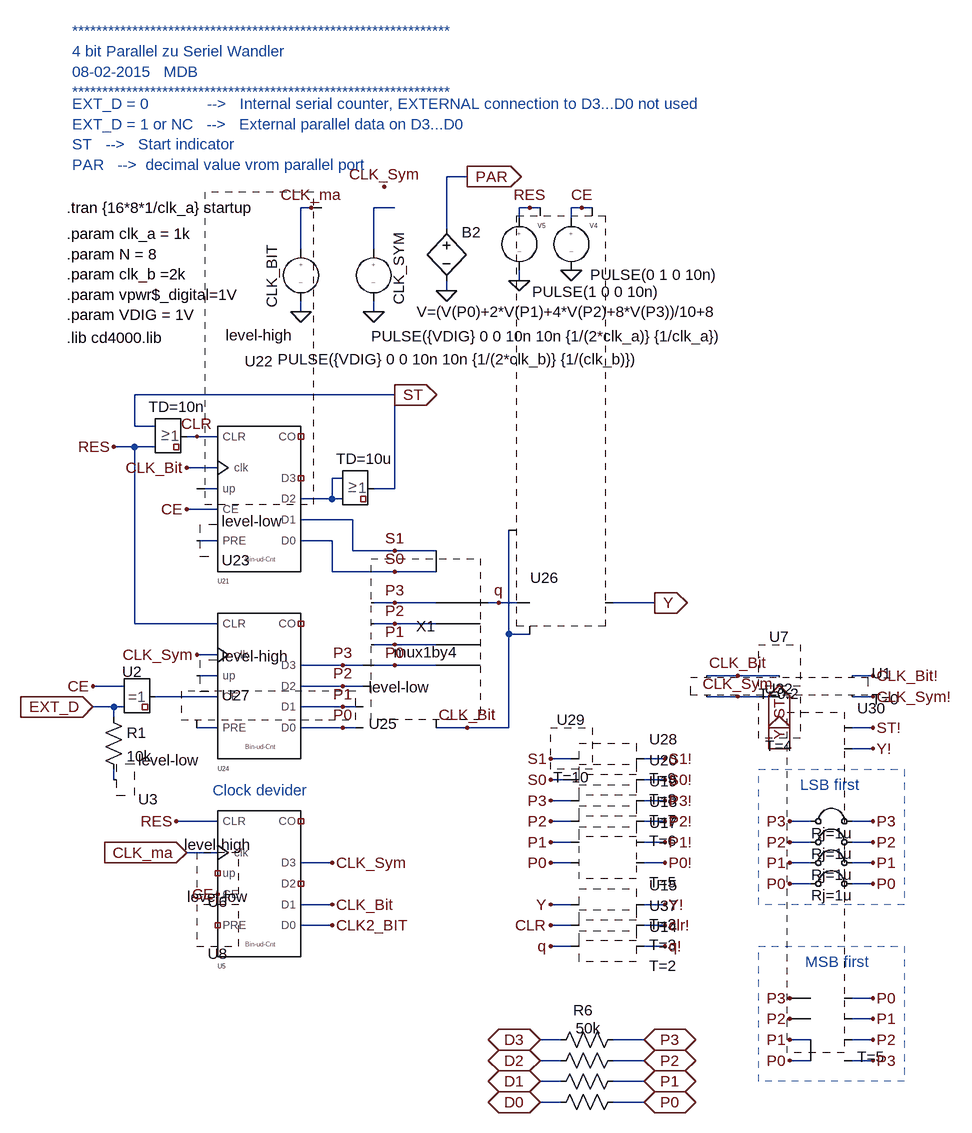
[diagram p0: schematic par4_to_serial_LOGIC_ANALYZER.asc]
par4_to_serial_LOGIC_ANALYZER.asc, the LTspice schematic file:
Version 4
SHEET 1 1748 680
WIRE 368 -992 336 -992
WIRE 128 -944 112 -944
WIRE 144 -944 128 -944
WIRE 256 -944 224 -944
WIRE 464 -944 448 -944
WIRE 480 -944 464 -944
WIRE 544 -944 528 -944
WIRE 560 -944 544 -944
WIRE 448 -928 448 -944
WIRE 528 -928 528 -944
WIRE 336 -912 336 -992
WIRE 112 -880 112 -944
WIRE 224 -880 224 -944
WIRE 448 -832 448 -848
WIRE 336 -816 336 -832
WIRE 112 -784 112 -800
WIRE 224 -784 224 -800
WIRE 256 -656 -144 -656
WIRE -144 -608 -144 -656
WIRE -112 -608 -144 -608
WIRE -48 -592 -64 -592
WIRE -16 -592 -48 -592
WIRE -144 -576 -176 -576
WIRE -112 -576 -144 -576
WIRE -16 -544 -64 -544
WIRE 176 -528 160 -528
WIRE -16 -512 -48 -512
WIRE 256 -512 256 -656
WIRE 256 -512 224 -512
WIRE 160 -496 160 -528
WIRE 160 -496 112 -496
WIRE 176 -496 160 -496
WIRE -16 -480 -64 -480
WIRE 192 -464 112 -464
WIRE -16 -432 -48 -432
WIRE 160 -432 112 -432
WIRE 192 -416 192 -464
WIRE 256 -416 192 -416
WIRE 320 -416 256 -416
WIRE 160 -384 160 -432
WIRE 256 -384 160 -384
WIRE 320 -384 256 -384
WIRE 256 -336 224 -336
WIRE 320 -336 256 -336
WIRE 416 -336 400 -336
WIRE 464 -336 416 -336
WIRE 656 -336 592 -336
WIRE -144 -304 -144 -576
WIRE -16 -304 -144 -304
WIRE 256 -304 224 -304
WIRE 320 -304 256 -304
WIRE 432 -288 432 -448
WIRE 464 -288 432 -288
WIRE 256 -272 224 -272
WIRE 320 -272 256 -272
WIRE -16 -256 -48 -256
WIRE 176 -240 112 -240
WIRE 208 -240 176 -240
WIRE 256 -240 224 -240
WIRE 320 -240 256 -240
WIRE -16 -224 -48 -224
WIRE 784 -224 736 -224
WIRE 848 -224 784 -224
WIRE 992 -224 960 -224
WIRE -160 -208 -208 -208
WIRE 176 -208 112 -208
WIRE 208 -208 176 -208
WIRE -16 -192 -112 -192
WIRE 784 -192 736 -192
WIRE 848 -192 784 -192
WIRE 992 -192 960 -192
WIRE -176 -176 -208 -176
WIRE -160 -176 -176 -176
WIRE 176 -176 112 -176
WIRE 208 -176 176 -176
WIRE -176 -160 -176 -176
WIRE -16 -144 -48 -144
WIRE 176 -144 112 -144
WIRE 208 -144 176 -144
WIRE 368 -144 320 -144
WIRE 432 -144 432 -288
WIRE 432 -144 368 -144
WIRE 992 -144 960 -144
WIRE 992 -112 960 -112
WIRE 528 -96 496 -96
WIRE 672 -96 640 -96
WIRE -176 -64 -176 -80
WIRE 528 -64 496 -64
WIRE 672 -64 640 -64
WIRE 528 -32 496 -32
WIRE 672 -32 640 -32
WIRE -16 0 -80 0
WIRE 528 0 496 0
WIRE 672 0 640 0
WIRE 896 0 864 0
WIRE 992 0 960 0
WIRE 528 32 496 32
WIRE 672 32 640 32
WIRE 896 32 864 32
WIRE 992 32 960 32
WIRE -16 48 -64 48
WIRE 160 64 112 64
WIRE 528 64 496 64
WIRE 672 64 640 64
WIRE 896 64 864 64
WIRE 992 64 960 64
WIRE 896 96 864 96
WIRE 992 96 960 96
WIRE 160 128 112 128
WIRE 528 128 496 128
WIRE 672 128 640 128
WIRE 160 160 112 160
WIRE 528 160 496 160
WIRE 672 160 640 160
WIRE 528 192 496 192
WIRE 672 192 640 192
WIRE 896 272 864 272
WIRE 992 272 960 272
WIRE 896 304 864 304
WIRE 992 304 960 304
WIRE 512 336 480 336
WIRE 640 336 592 336
WIRE 896 336 864 336
WIRE 992 336 960 336
WIRE 512 368 480 368
WIRE 640 368 592 368
WIRE 896 368 864 368
WIRE 992 368 960 368
WIRE 512 400 480 400
WIRE 640 400 592 400
WIRE 512 432 480 432
WIRE 640 432 592 432
FLAG 224 -784 0
FLAG 112 -784 0
FLAG 256 -416 S1
FLAG 256 -384 S0
FLAG 672 128 Y!
FLAG 672 64 P0!
FLAG 672 32 P1!
FLAG 672 0 P2!
FLAG 672 -32 P3!
FLAG 496 64 P0
FLAG 496 32 P1
FLAG 496 0 P2
FLAG 496 -32 P3
FLAG 544 -944 CE
FLAG 528 -848 0
FLAG -64 -480 CE
FLAG -208 -208 CE
FLAG 672 -64 S0!
FLAG 672 -96 S1!
FLAG 496 -64 S0
FLAG 496 -96 S1
FLAG 464 -944 RES
FLAG 448 -832 0
FLAG -176 -576 RES
FLAG 336 -816 0
FLAG 368 -992 PAR
IOPIN 368 -992 Out
FLAG 496 128 Y
FLAG 672 160 clr!
FLAG -48 -592 CLR
FLAG 496 160 CLR
FLAG 480 336 D3
IOPIN 480 336 BiDir
FLAG 480 368 D2
IOPIN 480 368 BiDir
FLAG 480 400 D1
IOPIN 480 400 BiDir
FLAG 480 432 D0
IOPIN 480 432 BiDir
FLAG -208 -176 EXT_D
IOPIN -208 -176 In
FLAG 992 -192 CLK_Sym!
FLAG 992 -224 CLK_Bit!
FLAG 256 -656 ST
IOPIN 256 -656 Out
FLAG -64 -544 CLK_Bit
FLAG -48 -256 CLK_Sym
FLAG -80 0 RES
FLAG -64 48 CLK_ma
IOPIN -64 48 In
FLAG -16 112 CE
FLAG 160 64 CLK_Sym
FLAG 128 -944 CLK_ma
FLAG 240 -976 CLK_Sym
FLAG 640 336 P3
IOPIN 640 336 BiDir
FLAG 640 368 P2
IOPIN 640 368 BiDir
FLAG 640 400 P1
IOPIN 640 400 BiDir
FLAG 640 432 P0
IOPIN 640 432 BiDir
FLAG 784 -224 CLK_Bit
FLAG 784 -192 CLK_Sym
FLAG 176 -240 P3
FLAG 176 -208 P2
FLAG 176 -176 P1
FLAG 176 -144 P0
FLAG 864 0 P3
FLAG 864 32 P2
FLAG 864 64 P1
FLAG 864 96 P0
FLAG 992 0 P3
FLAG 992 32 P2
FLAG 992 64 P1
FLAG 992 96 P0
FLAG 864 272 P3
FLAG 864 304 P2
FLAG 864 336 P1
FLAG 864 368 P0
FLAG 992 368 P3
FLAG 992 336 P2
FLAG 992 304 P1
FLAG 992 272 P0
FLAG 416 -336 q
FLAG 256 -336 P3
FLAG 256 -304 P2
FLAG 256 -272 P1
FLAG 256 -240 P0
FLAG 672 192 q!
FLAG 496 192 q
FLAG 992 -112 Y!
FLAG 160 128 CLK_Bit
FLAG 160 160 CLK2_BIT
FLAG 656 -336 Y
IOPIN 656 -336 Out
FLAG 992 -144 ST!
FLAG 848 -112 Y
IOPIN 848 -112 Out
FLAG 848 -144 ST
IOPIN 848 -144 Out
FLAG 368 -144 CLK_Bit
SYMBOL EIT_Digital\\probe_dig 848 -208 R0
SYMATTR Value T=0
SYMATTR InstName U1
SYMBOL source-V 224 -896 R0
WINDOW 3 -4 150 Left 2
WINDOW 123 0 0 Left 2
WINDOW 39 0 0 Left 2
WINDOW 0 39 -10 VRight 2
SYMATTR Value PULSE({VDIG} 0 0 10n 10n {1/(2*clk_a)} {1/clk_a})
SYMATTR InstName CLK_SYM
SYMBOL source-V 112 -896 R0
WINDOW 3 -36 185 Left 2
WINDOW 0 -45 9 VRight 2
WINDOW 123 0 0 Left 2
WINDOW 39 0 0 Left 2
SYMATTR Value PULSE({VDIG} 0 0 10n 10n {1/(2*clk_b)} {1/(clk_b)})
SYMATTR InstName CLK_BIT
SYMBOL EIT_Digital\\probe_dig 848 -240 R0
SYMATTR Value T=0.2
SYMATTR InstName U7
SYMBOL EIT_Digital\\probe_dig 528 112 R0
SYMATTR Value T=3
SYMATTR InstName U15
SYMBOL EIT_Digital\\probe_dig 528 48 R0
SYMATTR Value T=5
SYMATTR InstName U17
SYMBOL EIT_Digital\\probe_dig 528 16 R0
SYMATTR Value T=6
SYMATTR InstName U18
SYMBOL EIT_Digital\\probe_dig 528 -16 R0
SYMATTR Value T=7
SYMATTR InstName U19
SYMBOL EIT_Digital\\probe_dig 528 -48 R0
SYMATTR Value T=8
SYMATTR InstName U20
SYMBOL EIT_Digital\\Bin_up_down_counter -16 -432 M180
WINDOW 3 1 191 Invisible 2
SYMATTR InstName U21
SYMBOL EIT_Digital\\level-high -48 -512 M180
SYMATTR InstName U22
SYMBOL EIT_Digital\\level-low -48 -432 M180
SYMATTR InstName U23
SYMBOL EIT_Digital\\Bin_up_down_counter -16 -144 M180
WINDOW 3 1 191 Invisible 2
SYMATTR InstName U24
SYMBOL EIT_Digital\\level-low -48 -144 M180
SYMATTR InstName U25
SYMBOL source-V 528 -944 R0
WINDOW 3 29 103 Left 2
WINDOW 123 0 0 Left 2
WINDOW 39 0 0 Left 2
SYMATTR Value PULSE(0 1 0 10n)
SYMATTR InstName V4
SYMBOL EIT_Digital\\level-high -48 -224 M180
SYMATTR InstName U27
SYMBOL EIT_Digital\\probe_dig 528 -80 R0
SYMATTR Value T=9
SYMATTR InstName U28
SYMBOL EIT_Digital\\probe_dig 528 -112 R0
SYMATTR Value T=10
SYMATTR InstName U29
SYMBOL source-V 448 -944 R0
WINDOW 3 20 129 Left 2
WINDOW 123 0 0 Left 2
WINDOW 39 0 0 Left 2
SYMATTR Value PULSE(1 0 0 10n)
SYMATTR InstName V5
SYMBOL bv 336 -928 R0
WINDOW 0 23 22 Left 2
WINDOW 3 -46 144 Left 2
SYMATTR InstName B2
SYMATTR Value V=(V(P0)+2*V(P1)+4*V(P2)+8*V(P3))/10+8
SYMBOL MDB_sym\\OR2s -96 -592 R0
WINDOW 0 -19 -38 Invisible 2
WINDOW 3 -26 -46 Left 2
SYMATTR InstName U35
SYMBOL EIT_Digital\\probe_dig 528 144 R0
SYMATTR Value T=3
SYMATTR InstName U37
SYMBOL MDB_sym\\EXOR2s -144 -192 R0
SYMATTR InstName U2
SYMBOL res -192 -176 R0
SYMATTR InstName R1
SYMATTR Value 10k
SYMBOL EIT_Digital\\level-low -176 -64 M180
SYMATTR InstName U3
SYMBOL EIT_Digital\\Bin_up_down_counter -16 160 M180
WINDOW 3 1 191 Invisible 2
SYMATTR InstName U5
SYMBOL EIT_Digital\\level-high -16 80 M180
SYMATTR InstName U6
SYMBOL EIT_Digital\\level-low -16 160 M180
SYMATTR InstName U8
SYMBOL res 496 384 R270
WINDOW 0 46 50 Invisible 2
WINDOW 3 49 58 Invisible 2
SYMATTR InstName R3
SYMATTR Value 50k
SYMBOL res 496 416 R270
WINDOW 0 46 50 Invisible 2
WINDOW 3 49 58 Invisible 2
SYMATTR InstName R4
SYMATTR Value 50k
SYMBOL res 496 448 R270
WINDOW 0 46 50 Invisible 2
WINDOW 3 49 58 Invisible 2
SYMATTR InstName R5
SYMATTR Value 50k
SYMBOL res 496 352 R270
WINDOW 0 46 50 VTop 2
WINDOW 3 49 58 VBottom 2
SYMATTR InstName R6
SYMATTR Value 50k
SYMBOL MDB_sym\\jumperRes 928 -64 R0
WINDOW 0 0 40 Invisible 2
SYMATTR InstName U4
SYMBOL MDB_sym\\jumperRes 928 -32 R0
WINDOW 0 0 40 Invisible 2
SYMATTR InstName U9
SYMBOL MDB_sym\\jumperRes 928 0 R0
WINDOW 0 0 40 Invisible 2
SYMATTR InstName U10
SYMBOL MDB_sym\\jumperRes 928 32 R0
WINDOW 0 0 40 Invisible 2
SYMATTR InstName U11
SYMBOL mux1by4 352 -320 R0
SYMATTR InstName X1
SYMBOL EIT_Digital\\probe_dig 528 176 R0
SYMATTR Value T=2
SYMATTR InstName U14
SYMBOL EIT_Digital\\DFF 528 -352 R0
WINDOW 0 -63 -23 Left 2
WINDOW 3 -61 105 Invisible 2
WINDOW 38 -62 -20 Invisible 2
SYMATTR InstName U26
SYMBOL EIT_Digital\\probe_dig 848 -128 R0
SYMATTR Value T=5
SYMATTR InstName U30
SYMBOL EIT_Digital\\probe_dig 848 -160 R0
SYMATTR Value T=4
SYMATTR InstName U32
SYMBOL MDB_sym\\OR2s 192 -512 R0
WINDOW 0 -19 -38 Invisible 2
WINDOW 3 -26 -46 Left 2
SYMATTR InstName U13
SYMATTR Value TD=10u
TEXT -248 -944 Left 2 !.tran {16*8*1/clk_a} startup
TEXT -248 -744 Left 2 !.lib cd4000.lib
TEXT -248 -904 Left 2 !.param clk_a = 1k\n.param N = 8\n.param clk_b =2k\n.param vpwr$_digital=1V\n.param VDIG = 1V
TEXT -240 -1104 Left 2 ;EXT_D = 0             -->   Internal serial counter, EXTERNAL connection to D3...D0 not used\nEXT_D = 1 or NC   -->   External parallel data on D3...D0\nST   -->   Start indicator\nPAR   -->  decimal value vrom parallel port
TEXT -240 -1216 Left 2 ;***************************************************************\n4 bit Parallel zu Seriel Wandler\n08-02-2015   MDB\n***************************************************************
TEXT -24 -48 Left 2 ;Clock devider
TEXT 880 -56 Left 2 ;LSB first
TEXT 888 216 Left 2 ;MSB first
RECTANGLE Normal 1040 128 816 -80 2
RECTANGLE Normal 1040 400 816 192 2

The netlist it stands for:
* par4_to_serial_LOGIC_ANALYZER.asc
* U1: T=0 (symbol EIT_Digital\probe_dig not available, pin order unknown); nets seen at it: CLK_Bit, CLK_Bit!, CLK_Sym, CLK_Sym!
V§CLK_SYM N001 0 PULSE({VDIG} 0 0 10n 10n {1/(2*clk_a)} {1/clk_a})
V§CLK_BIT CLK_ma 0 PULSE({VDIG} 0 0 10n 10n {1/(2*clk_b)} {1/(clk_b)})
* U7: T=0.2 (symbol EIT_Digital\probe_dig not available, pin order unknown); nets seen at it: 
* U15: T=3 (symbol EIT_Digital\probe_dig not available, pin order unknown); nets seen at it: Y, Y!
* U17: T=5 (symbol EIT_Digital\probe_dig not available, pin order unknown); nets seen at it: P0, P0!, P1, P1!
* U18: T=6 (symbol EIT_Digital\probe_dig not available, pin order unknown); nets seen at it: P2, P2!
* U19: T=7 (symbol EIT_Digital\probe_dig not available, pin order unknown); nets seen at it: P3, P3!
* U20: T=8 (symbol EIT_Digital\probe_dig not available, pin order unknown); nets seen at it: S0, S0!
XU21 CE CLK_Bit CLR N004 S0 S1 N002 NC_01 NC_02 N003 bin_4_ud_cnt TD=10ns  ; pins CE clk CLR PRE D0 D1 D2 D3 CO up
* U22: level-high (symbol EIT_Digital\level-high not available, pin order unknown); nets seen at it: CLK_ma, N003
* U23: level-low (symbol EIT_Digital\level-low not available, pin order unknown); nets seen at it: N004
XU24 N006 CLK_Sym RES N007 P0 P1 P2 P3 NC_03 N005 bin_4_ud_cnt TD=10ns  ; pins CE clk CLR PRE D0 D1 D2 D3 CO up
* U25: level-low (symbol EIT_Digital\level-low not available, pin order unknown); nets seen at it: N007, P0, P1
V4 CE 0 PULSE(0 1 0 10n)
* U27: level-high (symbol EIT_Digital\level-high not available, pin order unknown); nets seen at it: N005
* U28: T=9 (symbol EIT_Digital\probe_dig not available, pin order unknown); nets seen at it: S1, S1!
* U29: T=10 (symbol EIT_Digital\probe_dig not available, pin order unknown); nets seen at it: 
V5 RES 0 PULSE(1 0 0 10n)
B2 PAR 0 V=(V(P0)+2*V(P1)+4*V(P2)+8*V(P3))/10+8
XU35 ST RES NC_04 CLR or_2 TD=10n  ; pins in1 in2 _Q Q
* U37: T=3 (symbol EIT_Digital\probe_dig not available, pin order unknown); nets seen at it: CLR, clr!
XU2 CE EXT_D NC_05 N006 exor_2 TD=10n  ; pins in1 in2 _Q Q
R1 EXT_D N008 10k
* U3: level-low (symbol EIT_Digital\level-low not available, pin order unknown); nets seen at it: N008
XU5 CE CLK_ma RES NC_06 CLK2_BIT CLK_Bit NC_07 CLK_Sym NC_08 NC_09 bin_4_ud_cnt TD=10ns  ; pins CE clk CLR PRE D0 D1 D2 D3 CO up
* U6: level-high (symbol EIT_Digital\level-high not available, pin order unknown); nets seen at it: 
* U8: level-low (symbol EIT_Digital\level-low not available, pin order unknown); nets seen at it: 
R3 D2 P2 50k
R4 D1 P1 50k
R5 D0 P0 50k
R6 D3 P3 50k
XU4 P3 P3 jumperResistor Rin=1t Rout=1t Rj=1u  ; pins + -
XU9 P2 P2 jumperResistor Rin=1t Rout=1t Rj=1u  ; pins + -
XU10 P1 P1 jumperResistor Rin=1t Rout=1t Rj=1u  ; pins + -
XU11 P0 P0 jumperResistor Rin=1t Rout=1t Rj=1u  ; pins + -
* X1: mux1by4 (symbol mux1by4 not available, pin order unknown); nets seen at it: CLK_Bit, P0, P1, P2, P3, q, S0, S1
* U14: T=2 (symbol EIT_Digital\probe_dig not available, pin order unknown); nets seen at it: q, q!
* U26: DFF (symbol EIT_Digital\DFF not available, pin order unknown); nets seen at it: CE, CLK_Bit, q, RES, Y
* U30: T=5 (symbol EIT_Digital\probe_dig not available, pin order unknown); nets seen at it: P0, P1, P2, P3, ST, ST!, Y, Y!
* U32: T=4 (symbol EIT_Digital\probe_dig not available, pin order unknown); nets seen at it: 
XU13 N002 N002 NC_10 ST or_2 TD=10u  ; pins in1 in2 _Q Q
.tran {16*8*1/clk_a} startup
.lib cd4000.lib
.param clk_a = 1k
.param N = 8
.param clk_b =2k
.param vpwr$_digital=1V
.param VDIG = 1V
* EXT_D = 0             -->   Internal serial counter, EXTERNAL connection to D3...D0 not used
* EXT_D = 1 or NC   -->   External parallel data on D3...D0
* ST   -->   Start indicator
* PAR   -->  decimal value vrom parallel port
* ***************************************************************
* 4 bit Parallel zu Seriel Wandler
* 08-02-2015   MDB
* ***************************************************************
* Clock devider
* LSB first
* MSB first
.lib EIT_sub\FF_and_Counters.sub
.lib EIT_sub\or_and_gates.sub
.lib MDB_sub/jumperRes.sub
.backanno
.end